# Altium schematic sheet Main.SchDoc
size A3; SheetNumber: 1; SheetTotal: 8; SPICEModelCacheTOCTCHPD: <root> / <DocumentId>TOCTCHPD</DocumentId> / </root>
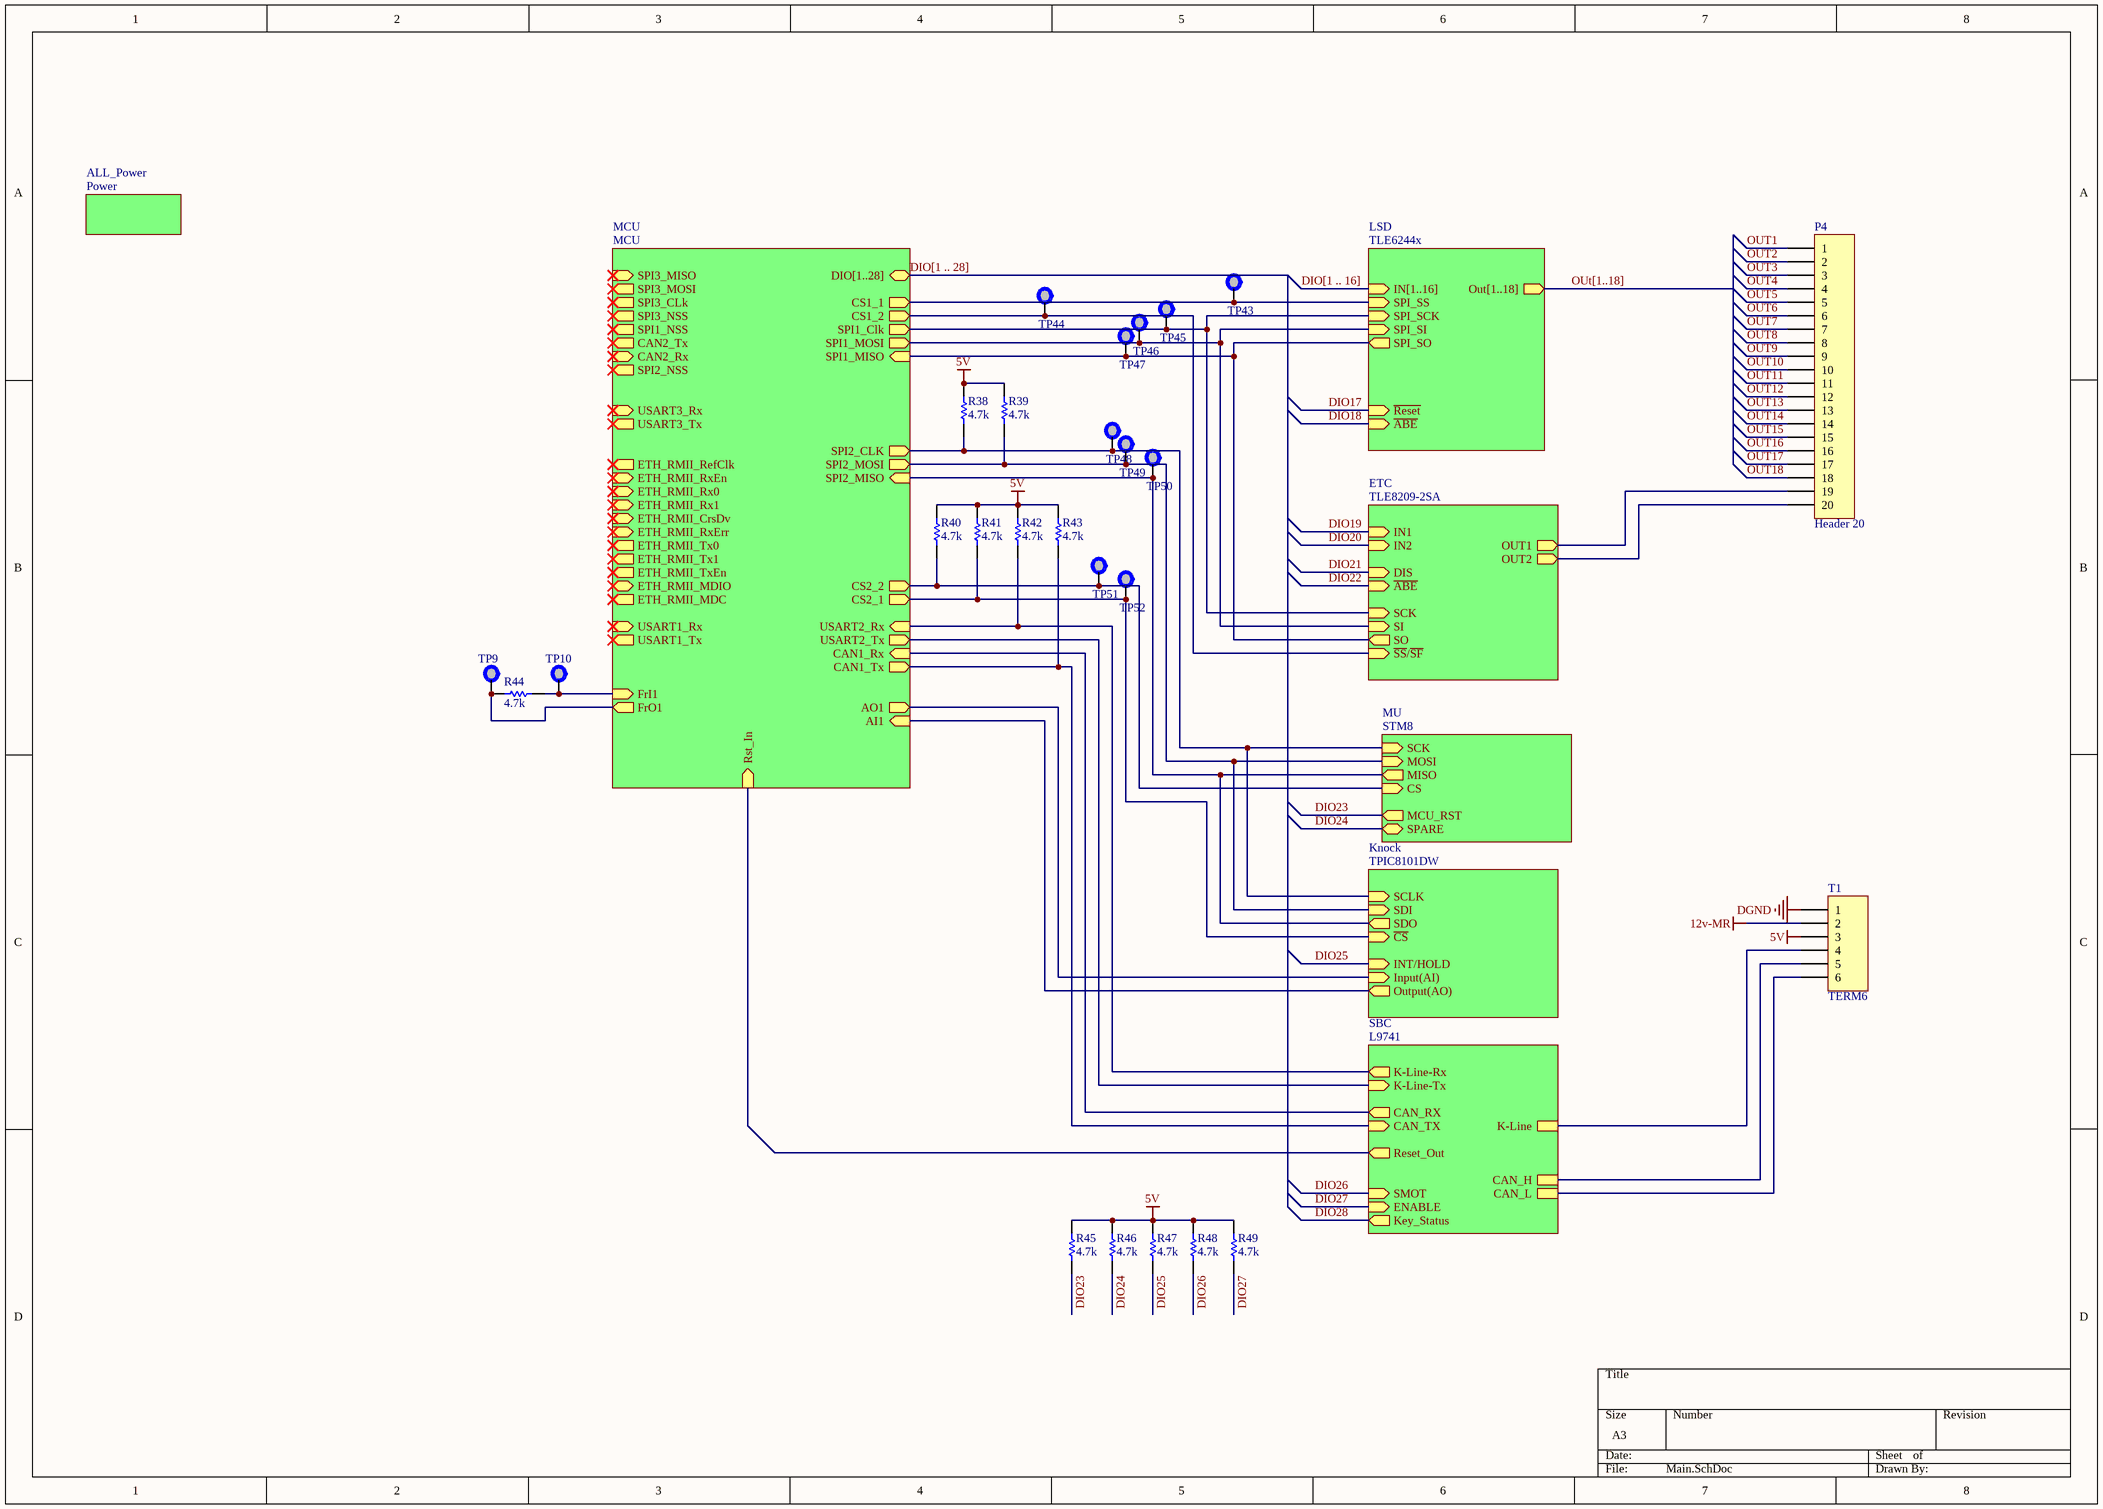
[diagram p0: Main.SchDoc]

## Parts
P4  Header 20  [HDR1X20]
R38  4.7K  [0805]
R39  4.7K  [0805]
R40  4.7K  [0805]
R41  4.7K  [0805]
R42  4.7K  [0805]
R43  4.7K  [0805]
R44  4.7K  [0805]
R45  4.7K  [0805]
R46  4.7K  [0805]
R47  4.7K  [0805]
R48  4.7K  [0805]
R49  4.7K  [0805]
T1  TERM6  [TERM6]
TP9  TestPoint  [TP]  (value not drawn)
TP10  TestPoint  [TP]  (value not drawn)
TP43  TestPoint  [TP]  (value not drawn)
TP44  TestPoint  [TP]  (value not drawn)
TP45  TestPoint  [TP]  (value not drawn)
TP46  TestPoint  [TP]  (value not drawn)
TP47  TestPoint  [TP]  (value not drawn)
TP48  TestPoint  [TP]  (value not drawn)
TP49  TestPoint  [TP]  (value not drawn)
TP50  TestPoint  [TP]  (value not drawn)
TP51  TestPoint  [TP]  (value not drawn)
TP52  TestPoint  [TP]  (value not drawn)

## Sub-sheets
ALL_Power = Power: no entries
ETC = TLE8209-2SA: IN1 (in), IN2 (in), DIS (in), ~{ABE} (in), SCK (in), SI (in), SO (out), ~{SS}/~{SF} (in), OUT1 (out), OUT2 (out)
Knock = TPIC8101DW: Output(AO) (out), SCLK (in), SDI (in), SDO (out), ~{CS} (in), INT/HOLD (in), Input(AI) (in)
LSD = TLE6244x: IN[1..16] (in), SPI_SS (in), SPI_SO (out), SPI_SCK (in), SPI_SI (in), ~{Reset} (in), ~{ABE} (in), Out[1..18] (out)
MCU = MCU: DIO[1..28] (bidir), ETH_RMII_RefClk (out), ETH_RMII_MDIO (bidir), ETH_RMII_CrsDv (in), ETH_RMII_RxErr (in), ETH_RMII_MDC (out), ETH_RMII_Rx0 (in), ETH_RMII_Rx1 (in), ETH_RMII_TxEn (out), ETH_RMII_RxEn (in), ETH_RMII_Tx0 (out), ETH_RMII_Tx1 (out), SPI1_Clk (out), SPI1_MISO (in), SPI1_MOSI (out), SPI1_NSS (out), SPI2_NSS (out), SPI2_CLK (out), SPI2_MOSI (out), SPI2_MISO (in), SPI3_MISO (in), SPI3_MOSI (out), SPI3_CLk (out), SPI3_NSS (out), CAN1_Rx (in), CAN1_Tx (out), CAN2_Tx (out), CAN2_Rx (in), USART1_Rx (in), USART1_Tx (out), USART2_Tx (out), USART2_Rx (in), USART3_Rx (in), USART3_Tx (out), AI1 (in), AO1 (out), CS1_1 (out), CS1_2 (out), CS2_1 (out), CS2_2 (out), Rst_In (in), FrI1 (in), FrO1 (out)
MU = STM8: SCK (in), MISO (out), MOSI (in), CS (in), MCU_RST (out), SPARE (bidir)
SBC = L9741: K-Line-Rx (out), K-Line-Tx (in), CAN_RX (out), CAN_TX (in), CAN_L, CAN_H, Reset_Out (out), SMOT (in), K-Line, ENABLE (in), Key_Status (out)

## Nets
5V: R38.2 R39.2 R40.1 R41.2 R42.2 R43.2 R45.1 R46.1 R47.1 R48.1 R49.1 T1.3
12v-MR: T1.2
DGND: T1.1
DIO17: sheet LSD/~{Reset}
DIO18: sheet LSD/~{ABE}
DIO19: sheet ETC/IN1
DIO20: sheet ETC/IN2
DIO21: sheet ETC/DIS
DIO22: sheet ETC/~{ABE}
DIO23: R45.2 ; sheet MU/MCU_RST
DIO24: R46.2 ; sheet MU/SPARE
DIO25: R47.2 ; sheet Knock/INT/HOLD
DIO26: R48.2 ; sheet SBC/SMOT
DIO27: R49.2 ; sheet SBC/ENABLE
DIO28: sheet SBC/Key_Status
OUT1: P4.1
OUT2: P4.2
OUT3: P4.3
OUT4: P4.4
OUT5: P4.5
OUT6: P4.6
OUT7: P4.7
OUT8: P4.8
OUT9: P4.9
OUT10: P4.10
OUT11: P4.11
OUT12: P4.12
OUT13: P4.13
OUT14: P4.14
OUT15: P4.15
OUT16: P4.16
OUT17: P4.17
OUT18: P4.18
NetP4_19: P4.19 ; sheet ETC/OUT1
NetP4_20: P4.20 ; sheet ETC/OUT2
NetR38_1: R38.1 TP48.1 ; sheet MCU/SPI2_CLK, sheet Knock/SCLK, sheet MU/SCK
NetR39_1: R39.1 TP49.1 ; sheet MCU/SPI2_MOSI, sheet Knock/SDI, sheet MU/MOSI
NetR40_2: R40.2 TP51.1 ; sheet MCU/CS2_2, sheet MU/CS
NetR41_1: R41.1 TP52.1 ; sheet MCU/CS2_1, sheet Knock/~{CS}
NetR42_1: R42.1 ; sheet MCU/USART2_Rx, sheet SBC/K-Line-Rx
NetR43_1: R43.1 ; sheet MCU/CAN1_Tx, sheet SBC/CAN_TX
NetR44_1: R44.1 TP9.1 ; sheet MCU/FrO1
NetR44_2: R44.2 TP10.1 ; sheet MCU/FrI1
NetT1_4: T1.4 ; sheet SBC/K-Line
NetT1_5: T1.5 ; sheet SBC/CAN_H
NetT1_6: T1.6 ; sheet SBC/CAN_L
NetTP43_1: TP43.1 ; sheet MCU/CS1_1, sheet LSD/SPI_SS
NetTP44_1: TP44.1 ; sheet MCU/CS1_2, sheet ETC/~{SS}/~{SF}
NetTP45_1: TP45.1 ; sheet MCU/SPI1_Clk, sheet LSD/SPI_SCK, sheet ETC/SCK
NetTP46_1: TP46.1 ; sheet MCU/SPI1_MOSI, sheet LSD/SPI_SI, sheet ETC/SI
NetTP47_1: TP47.1 ; sheet MCU/SPI1_MISO, sheet LSD/SPI_SO, sheet ETC/SO
NetTP50_1: TP50.1 ; sheet MCU/SPI2_MISO, sheet Knock/SDO, sheet MU/MISO
(unnamed): sheet MCU/CAN1_Rx, sheet SBC/CAN_RX
(unnamed): sheet MCU/USART2_Tx, sheet SBC/K-Line-Tx
(unnamed): sheet MCU/AI1, sheet Knock/Output(AO)
(unnamed): sheet MCU/AO1, sheet Knock/Input(AI)
(unnamed): sheet MCU/Rst_In, sheet SBC/Reset_Out

## Buses and harness runs
bus DIO[1 .. 16] = sheet LSD/IN[1..16]
bus DIO[1 .. 28] = sheet MCU/DIO[1..28]
bus OUt[1..18] = sheet LSD/Out[1..18]

## Library data of the parts
P4 = Header 20: Header, 20-Pin; LatestRevisionDate: 17-Jul-2002; LatestRevisionNote: Re-released for DXP Platform.; Publisher: Altium Limited
R38-R49 = Res1: Resistor; Published: 8-Jun-2000; LatestRevisionDate: 17-Jul-2002; LatestRevisionNote: Re-released for DXP Platform.; PackageReference: AXIAL-0.3; Publisher: Altium Limited; PackageDescription: Axial Device, Thru-Hole; 2 Leads; 0.3 in Pin Spacing; Value: 4.7k
T1 = MHDR1X6: Header, 6-Pin; LatestRevisionDate: 17-Jul-2002; LatestRevisionNote: Re-released for DXP Platform.; Publisher: Altium Limited